# Altium schematic sheet INVERTER_ALTIUM.SchDoc
size A; SheetNumber: 1; SheetTotal: 1
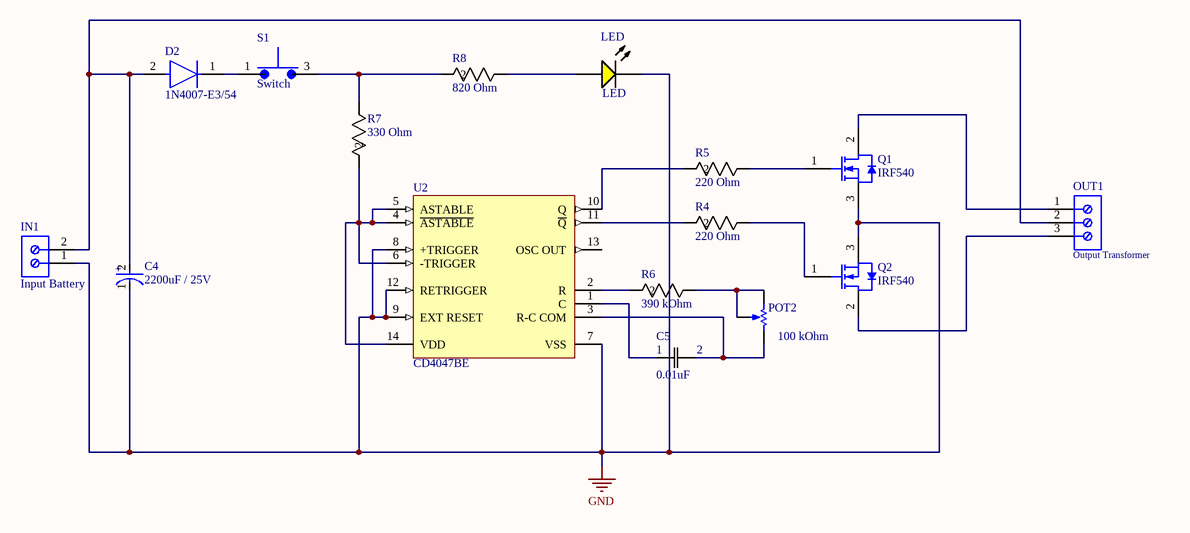
[diagram p0: INVERTER_ALTIUM.SchDoc]

## Parts
C4  2200uF / 25V  [FP-RAD-TH-D_16_0_5-L_25_2-MFG]
C5  0.01uF  [CAP_C315_KEM]
D2  1N4007-E3/54  [FP-1N4007-MFG]
IN1  Input Battery  [691102710002]
LED  LED  [KING-WP7113SYD_V]
OUT1  Output Transformer  [691102710003]
POT2  100 kOhm  [BOUR-3362P]
Q1  IRF540  [NXP-SOT78A]
Q2  IRF540  [NXP-SOT78A]
R4  220 Ohm  [RES_PRO1]
R5  220 Ohm  [RES_PRO1]
R6  390 kOhm  [RES_PRO1]
R7  330 Ohm  [RES_PRO1]
R8  820 Ohm  [RES_PRO1]
S1  Switch  [SW_PMS9P1B10M2QE]
U2  CD4047BE  [N0014A]

## Nets
GND: C4.1(C) IN1.1 LED.2(K) Q1.3(S) Q2.3(S) U2.7(VSS) U2.8(+TRIGGER) U2.9(EXT_RESET) U2.12(RETRIGGER)
NetC4_2: C4.2(A) D2.2(A) IN1.2 OUT1.2
NetC5_1: C5.1 U2.1(C)
NetC5_2: C5.2 POT2.1(CCW) U2.3(R-C_COM)
NetD2_1: D2.1(C) S1.1
NetLED_1: LED.1(A) R8.1
NetOUT1_1: OUT1.1 Q1.2(D)
NetOUT1_3: OUT1.3 Q2.2(D)
NetPOT2_2: POT2.2(S) POT2.3(CW) R6.1
NetQ1_1: Q1.1(G) R5.1
NetQ2_1: Q2.1(G) R4.1
NetR4_2: R4.2 U2.11(~{Q})
NetR5_2: R5.2 U2.10(Q)
NetR6_2: R6.2 U2.2(R)
NetR7_1: R7.1 R8.2 S1.3
NetR7_2: R7.2 U2.4(~{ASTABLE}) U2.5(ASTABLE) U2.6(-TRIGGER) U2.14(VDD)

Not connected (* = marked no-connect by the designer): U2 13(OSC_OUT)

## Notes on the sheet
- (in symbol CMP-05427-000889-1) +

## Library data of the parts
C4 = CMP-05427-000889-1: Aluminum Electrolytic Capacitors (Radial Lead Type) AEC-Q200 Qualified 2200uF ±20% 25V; Outside Diameter: 16mm; Lead/Base Style: Straight; Leakage Current: 550uA; ESR (Equivalent Series Resistance): 22mR; Capacitance: 2.2mF; Life (Hours): 2000Hour; Ripple Current (AC): 2.76A; Ripple Current: 2.3A; Lead Diameter: 0.8mm; Voltage Rating (DC): 25V; Lead Pitch: 7.5mm; Construction: RADIAL; Tolerance: 20%; Mount: Through Hole; Number of Pins: 2; Min Operating Temperature: -40°C; Package Quantity: 100; Radiation Hardening: No; Height: 25mm; RoHS Compliant: Yes; Termination: Radial; Voltage Rating: 25V; Diameter: 16mm; Packaging: Bulk; Case/Package: Radial; Series: TP; Voltage: 25V; Length: 25mm; Max Operating Temperature: 135°C; Height - Seated (Max): 1.063inch; REACH SVHC: No SVHC
C5 = C315C103M1U5TA: No Description Available; Mfr_Name: Kemet; Type: DEV; Copyright: Copyright (C) 2022 Ultra Librarian. All rights reserved.; Manufacturer_Part_Number: C315C103M1U5TA; Digi-Key_Part_Number_1: 399-4149-ND; RefDes: RefDes
D2 = CMP-02540-000046-1: DIODE GEN PURP 1KV 1A DO204AL; Manufacturer: Vishay; Value: 15pF; Max Junction Temp: +150°C; Max Surge Forward Current: 30A; Max Repetitive Reverse Voltage: 1000V; Peak Reverse Current: 30uA; Octopart: https://octopart.com/1n4007-e3%2F54-vishay-39548207; Digikey Description: DIODE GEN PURP 1KV 1A DO204AL; Category: Diode; Mouser Description: Rectifiers Vr/1000V Io/1A; Automotive: No; Package: 1N4007; Device Class L3: Rectifier Diodes; Temperature Range High: +150°C; Capacitance: 15pF; Ipc Land Pattern Name: DIOPA1088W105L520D270; Lead Free: Yes; ComponentLink2Description: Datasheet; Forward Current: 1A; Device Class L1: Discrete Semiconductors; ComponentLink2URL: http://www.vishay.com/docs/88503/1n4001.pdf; Temperature Range Low: -50°C; Height: 2.7mm; RoHS: TRUE; Temperature: -50°C to +150°C; Device Class L2: Diodes; Manufacturer Part Number: 1N4007-E3/54
IN1 = CMP-1502-03258-1: Series 102 - 5.00 mm Horizontal Entry Modular with Pressure Clamp WR-TBL, 2 pin; Manufacturer: Wurth Elektronik; Pin Number: 2; Pitch: 5.00mm; Manufacturer URL: http://www.we-online.de; Mounting Technology: THT; Publisher: WurthElektronik; Packaging: Box; Package Reference: 691102710002; Datasheet URL: http://katalog.we-online.de/em/datasheet/6911027100xx.pdf; Operating Temperature: -40to105degC; Part Number: 691102710002
LED = CMP-1757-00003-1: The Super Bright Yellow Device, 2 V, -40 to 85 degC, 2-Pin THD, RoHS, Tape and Reel; Tolerance: 1%; Power Rating: 250 mW; Voltage Rating: 250 V; Resistance: 22.1 kohm; Case\Package: Axial; Length: 0.248 inch; Max Operating Temperature: 155 degC; PackageDescription: 2-Pin Through Hole Device, Dia 5.9 mm, Body Length 8.6 mm; Package Quantity: 200; ComponentLink1Description: Datasheet; Mount: Through Hole; DatasheetVersion: Rev. 7B, 01/2015; RoHSCompliant: true; PackageReference: WP7113SYD; ComponentLink1URL: http://www.kingbrightusa.com/images/catalog/SPEC/WP7113SYD.pdf; Packaging: Bulk; Min Operating Temperature: -55 degC
OUT1 = CMP-1502-03259-1: Series 102 - 5.00 mm Horizontal Entry Modular with Pressure Clamp WR-TBL, 3 pin; Manufacturer: Wurth Elektronik; Pitch: 5.00mm; Pin Number: 3; Operating Temperature: -40to105degC; Package Reference: 691102710003; Publisher: WurthElektronik; Datasheet URL: http://katalog.we-online.de/em/datasheet/6911027100xx.pdf; Manufacturer URL: http://www.we-online.de; Part Number: 691102710003; Mounting Technology: THT; Packaging: Box
POT2 = CMP-1747-00004-1: Square Trimpot(R) Trimming Potentiometer, 10 KOhm, 300 V, -55 to 125 degC, 3-Pin THD, RoHS, Tube; Voltage Rating: 220 mV; Power Rating: 1 W; Tolerance: 1%; Resistance: 50 mohm; Case/Package: 1206; Length: 3.2 mm; RoHSCompliant: True; PackageDescription: 3-Pin Through Hole Device, Body 6.6 x 6.99 mm, Pitch 2.54 mm; ComponentLink2Description: Datasheet; REACH SVHC: No SVHC; Mount: Surface Mount; Height: 0.6 mm; Packaging: Tape and Reel; ComponentLink1URL: http://www.bourns.com/; Case Code (Imperial): 0612; Pins: 2; Case Code (Metric): 1632; ComponentLink2URL: http://www.bourns.com/docs/Product-Datasheets/3362.pdf; Min Operating Temperature: -25degC; ComponentLink1Description: Manufacturer URL; PackageReference: 3326P; Max Operating Temperature: 125degC; Width: 1.6 mm; Package Quantity: 5000; DatasheetVersion: May-16
Q1 Q2 = CMP-1259-00528-1: N-Channel TrenchMOS Logic Level FET, 100 V, 46 A, 3-Pin SOT78A, Rail; Manufacturer: NXP Semiconductors; PartNumber: BUK9529-100B,127; Automotive Qualified: Y; VDS [max] (V): 100; IDM [max] (A): 186; ID [max] (A): 46; VGSth [typ] (V): 1.5; Qr [typ] (nC): 196; Channel Type: N; ComponentLink2Description: Datasheet; Code_JEDEC: 3-lead TO-220AB; ComponentLink1URL: http://www.nxp.com/; ComponentLink3Description: Package Specification; Mounting Technology: Through Hole; Code_JEITA: SC-46; PackageVersion: 05-03-14, 03/2005; Packing: Rail; ComponentLink1Description: Manufacturer URL; DatasheetVersion: Rev. 02; ComponentLink3URL: http://www.nxp.com/documents/outline_drawing/sot078a_po.pdf; PackageReference: SOT78A; PackageDescription: 3-Pin Flange Mount, Vertical Straight Lead, Body 10 x 4.3 mm, Pitch 2.54 mm; ComponentLink2URL: http://www.nxp.com/documents/data_sheet/BUK9529-100B.pdf
R4-R8 = PR01000101001JA100: No Description Available; Mfr_Name: Vishay; Copyright: Copyright (C) 2022 Ultra Librarian. All rights reserved.; Manufacturer_Part_Number: PR01000101001JA100; Digi-Key_Part_Number_1: BC4684CT-ND; Digi-Key_Part_Number_2: BC4684TB-ND; RefDes: RefDes; Type: DEV
S1 = PMS9P1B10M2QE: Pushbutton Switch SPST-NO Standard Through Hole; MF: TE Connectivity ALCOSWITCH Switches; Price: None; MP: PMS9P1B10M2QE; Availability: In Stock; SnapEDA_Link: https://www.snapeda.com/parts/PMS9P1B10M2QE/TE%20Connectivity/view-part/4303237/?ref=snap; Check_prices: https://www.snapeda.com/parts/PMS9P1B10M2QE/TE%20Connectivity/view-part/4303237/?ref=eda; Value: *; Package: None; Purchase-URL: https://pricing.snapeda.com/search/part/PMS9P1B10M2QE/?ref=eda
U2 = CMP-1629-00101-2: CMOS Low-Power Monostable/Astable Multivibrator, N0014A, TUBE; Manufacturer: Texas Instruments; Rating: Military; Voltage(Nom)(V): 10; VCC(Min)(V): 3; F @ Nom Voltage(Max)(Mhz): 8; Technology Family: CD4000; VCC(Max)(V): 18; tpd @ Nom Voltage(Max)(ns): 450; ICC @ Nom Voltage(Max)(mA): 0.06; Bits(#): 1; Output Drive (IOL/IOH)(Max)(mA): 4/-4; Output Type: CMOS; Input Type: CMOS; Operating Temperature Range(C): -55 to 125; PackageReference: N0014A; Code_JEDEC: MS-001; DatasheetVersion: SCHS044C; Generic Part Number: CD4047B